# EAGLE design pyboard (EAGLE 6.5.0)
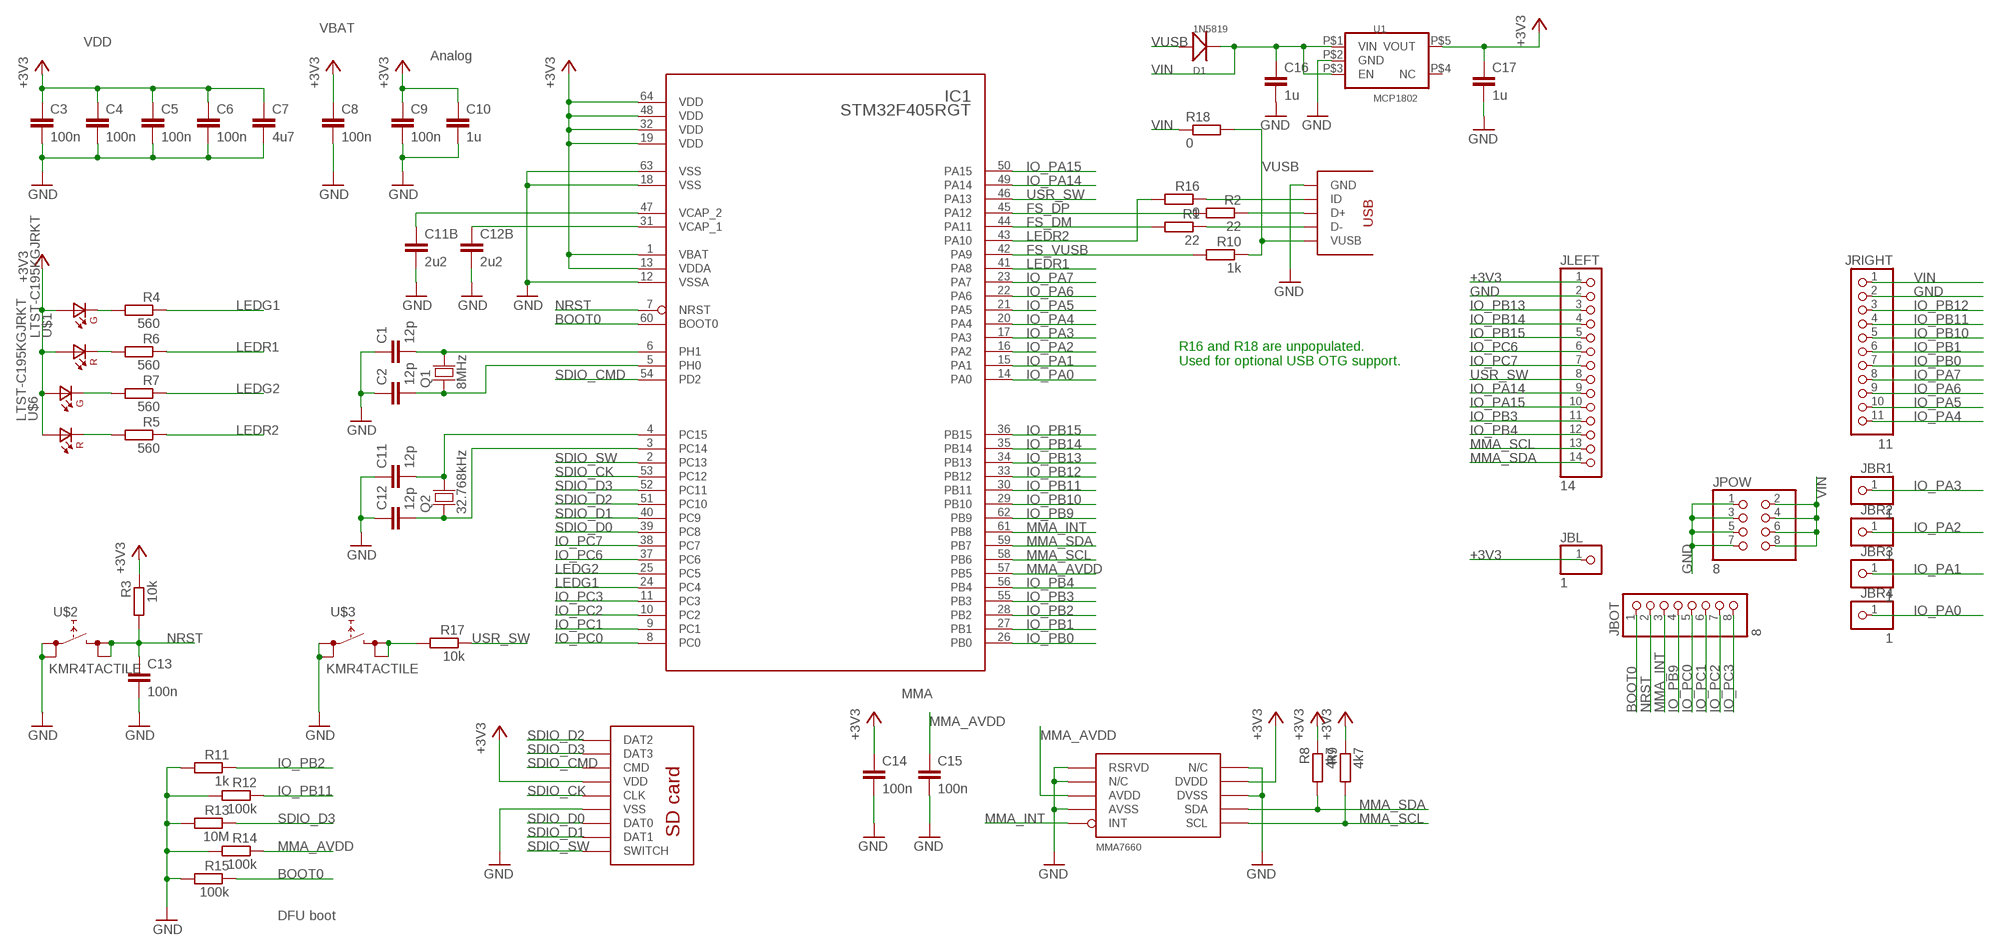
[diagram p0: schematic, sheet 1]

## Parts
C1  12p  C-EUC0603  [C0603]
C2  12p  C-EUC0603  [C0603]
C3  100n  C-EUC0603  [C0603]
C4  100n  C-EUC0603  [C0603]
C5  100n  C-EUC0603  [C0603]
C6  100n  C-EUC0603  [C0603]
C7  4u7  C-EUC0603  [C0603]
C8  100n  C-EUC0603  [C0603]
C9  100n  C-EUC0603  [C0603]
C10  1u  C-EUC0603  [C0603]
C11  12p  C-EUC0603  [C0603]
C11B  2u2  C-EUC0603  [C0603]
C12  12p  C-EUC0603  [C0603]
C12B  2u2  C-EUC0603  [C0603]
C13  100n  C-EUC0603  [C0603]
C14  100n  C-EUC0603  [C0603]
C15  100n  C-EUC0603  [C0603]
C16  1u  C-EUC0603  [C0603]
C17  1u  C-EUC0603  [C0603]
D1  1N5819  [SOD-123]
IC1  STM32F405RGT  [LQFP64]
JBL  1  PINHD-1X1  [1X01]
JBOT  8  PINHD-1X8  [1X08]
JBR1  1  PINHD-1X1  [1X01]
JBR2  1  PINHD-1X1  [1X01]
JBR3  1  PINHD-1X1  [1X01]
JBR4  1  PINHD-1X1  [1X01]
JLEFT  14  PINHD-1X14  [1X14]
JPOW  8  PINHD-2X4  [2X04]
JRIGHT  11  PINHD-1X11  [1X11]
Q1  8MHz  TXC-CRYSTAL50X32  [TXC-SMD-50X32]
Q2  32.768kHz  TXC-CRYSTAL32X15  [TXC-SMD-32X15]
R1  22  R-EU_R0603  [R0603]
R2  22  R-EU_R0603  [R0603]
R3  10k  R-EU_R0603  [R0603]
R4  560  R-EU_R0603  [R0603]
R5  560  R-EU_R0603  [R0603]
R6  560  R-EU_R0603  [R0603]
R7  560  R-EU_R0603  [R0603]
R8  4k7  R-EU_R0603  [R0603]
R9  4k7  R-EU_R0603  [R0603]
R10  1k  R-EU_R0603  [R0603]
R11  1k  R-EU_R0603  [R0603]
R12  100k  R-EU_R0603  [R0603]
R13  10M  R-EU_R0603  [R0603]
R14  100k  R-EU_R0603  [R0603]
R15  100k  R-EU_R0603  [R0603]
R16  0  R-EU_R0603  [R0603]
R17  10k  R-EU_R0603  [R0603]
R18  0  R-EU_R0805  [R0805]
U1  MCP1802  [SOT-23-5]
U$1  LTST-C195KGJRKT  [LTST-BILED-15X16]
U$2  KMR4TACTILE  [KMR4SWITCH]
U$3  KMR4TACTILE  [KMR4SWITCH]
U$4  MOLEX-SD-105027  [MOLEX-SD-105027-PKG]
U$5  MMA7660  [DFN10]
U$6  LTST-C195KGJRKT  [LTST-BILED-15X16]
U$7  USB-MICRO-AB  [HRS-USB-ZX62D-AB-5P8-PKG]

## Nets
+3V3: C3.1 C4.1 C5.1 C6.1 C7.1 C8.1 C9.1 C10.1 C14.1 C17.1 IC1.1(VBAT) IC1.13(VDDA) IC1.19(VDD) IC1.32(VDD) IC1.48(VDD) IC1.64(VDD) JBL.1 JLEFT.1 R3.1 R8.1 R9.1 U1.P$5(VOUT) U$1.P$1(A1) U$1.P$2(A2) U$4.P$4(VDD) U$5.P$9(DVDD) U$6.P$1(A1) U$6.P$2(A2)
BOOT0: IC1.60(BOOT0) JBOT.1 R15.1
FS_DM: IC1.44(PA11) R1.2
FS_DP: IC1.45(PA12) R2.2
FS_VUSB: IC1.42(PA9) R10.2
GND: C1.1 C2.1 C3.2 C4.2 C5.2 C6.2 C7.2 C8.2 C9.2 C10.2 C11.1 C11B.2 C12.1 C12B.2 C13.2 C14.2 C15.2 C16.2 C17.2 IC1.12(VSSA) IC1.18(VSS) IC1.63(VSS) JLEFT.2 JPOW.1 JPOW.3 JPOW.5 JPOW.7 JRIGHT.2 R11.2 R12.2 R13.2 R14.2 R15.2 U1.P$2(GND) U$2.P$1 U$2.P$2 U$3.P$1 U$3.P$2 U$4.P$6(VSS) U$5.P$1(RSRVD) U$5.P$2(N/C) U$5.P$4(AVSS) U$5.P$8(DVSS) U$5.P$10(N/C) U$7.P$5(GND)
IO_PA0: IC1.14(PA0) JBR4.1
IO_PA1: IC1.15(PA1) JBR3.1
IO_PA2: IC1.16(PA2) JBR2.1
IO_PA3: IC1.17(PA3) JBR1.1
IO_PA4: IC1.20(PA4) JRIGHT.11
IO_PA5: IC1.21(PA5) JRIGHT.10
IO_PA6: IC1.22(PA6) JRIGHT.9
IO_PA7: IC1.23(PA7) JRIGHT.8
IO_PA14: IC1.49(PA14) JLEFT.9
IO_PA15: IC1.50(PA15) JLEFT.10
IO_PB0: IC1.26(PB0) JRIGHT.7
IO_PB1: IC1.27(PB1) JRIGHT.6
IO_PB2: IC1.28(PB2) R11.1
IO_PB3: IC1.55(PB3) JLEFT.11
IO_PB4: IC1.56(PB4) JLEFT.12
IO_PB9: IC1.62(PB9) JBOT.4
IO_PB10: IC1.29(PB10) JRIGHT.5
IO_PB11: IC1.30(PB11) JRIGHT.4 R12.1
IO_PB12: IC1.33(PB12) JRIGHT.3
IO_PB13: IC1.34(PB13) JLEFT.3
IO_PB14: IC1.35(PB14) JLEFT.4
IO_PB15: IC1.36(PB15) JLEFT.5
IO_PC0: IC1.8(PC0) JBOT.5
IO_PC1: IC1.9(PC1) JBOT.6
IO_PC2: IC1.10(PC2) JBOT.7
IO_PC3: IC1.11(PC3) JBOT.8
IO_PC6: IC1.37(PC6) JLEFT.6
IO_PC7: IC1.38(PC7) JLEFT.7
LEDG1: IC1.24(PC4) R4.1
LEDG2: IC1.25(PC5) R7.1
LEDR1: IC1.41(PA8) R6.1
LEDR2: IC1.43(PA10) R5.1 R16.2
MMA_AVDD: C15.1 IC1.57(PB5) R14.1 U$5.P$3(AVDD)
MMA_INT: IC1.61(PB8) JBOT.3 U$5.P$5(INT)
MMA_SCL: IC1.58(PB6) JLEFT.13 R9.2 U$5.P$6(SCL)
MMA_SDA: IC1.59(PB7) JLEFT.14 R8.2 U$5.P$7(SDA)
N$1: C11B.1 IC1.47(VCAP_2)
N$2: C12B.1 IC1.31(VCAP_1)
N$3: R2.1 U$7.P$3(D+)
N$4: R1.1 U$7.P$2(D-)
N$5: C12.2 IC1.3(PC14) Q2.P$1
N$6: C11.2 IC1.4(PC15) Q2.P$2
N$7: R16.1 U$7.P$4(ID)
N$9: C1.2 IC1.6(PH1) Q1.P$2
N$10: C2.2 IC1.5(PH0) Q1.P$1
N$11: R4.2 U$1.P$3(K1)
N$12: R5.2 U$6.P$4(K2)
N$13: R6.2 U$1.P$4(K2)
N$14: R7.2 U$6.P$3(K1)
N$15: R17.2 U$3.P$3 U$3.P$4
NRST: C13.1 IC1.7(NRST) JBOT.2 R3.2 U$2.P$3 U$2.P$4
SDIO_CK: IC1.53(PC12) U$4.P$5(CLK)
SDIO_CMD: IC1.54(PD2) U$4.P$3(CMD)
SDIO_D0: IC1.39(PC8) U$4.P$7(DAT0)
SDIO_D1: IC1.40(PC9) U$4.P$8(DAT1)
SDIO_D2: IC1.51(PC10) U$4.P$1(DAT2)
SDIO_D3: IC1.52(PC11) R13.1 U$4.P$2(DAT3)
SDIO_SW: IC1.2(PC13) U$4.G$1(SWITCH)
USR_SW: IC1.46(PA13) JLEFT.8 R17.1
VIN: C16.1 D1.K JPOW.2 JPOW.4 JPOW.6 JPOW.8 JRIGHT.1 R18.1 U1.P$1(VIN) U1.P$3(EN)
VUSB: D1.A R10.1 R18.2 U$7.P$1(VUSB)
Unconnected: U1.P$4(NC)

## Notes on the sheet
- VBAT
- VDD
- Analog
- R16 and R18 are unpopulated.
  Used for optional USB OTG support.
- MMA
- DFU boot

## Library data of the parts
C1-C11 C11B C12 C12B C13-C17 = rcl:C-EU: CAPACITOR, European symbol
D1 = pyboard:1N5819
IC1 = pyboard:STM32F405R*T: STM32F405R*T ARM Cortex-M4 32b MCU+FPU, 210DMIPS, up to 1MB Flash/192+4KB RAM, USB OTG HS/FS, 17 TIMs, 3 ADCs, 15 comm.
JBL JBR1-JBR4 = pinhead:PINHD-1X1: PIN HEADER
JBOT = pinhead:PINHD-1X8: PIN HEADER
JLEFT = pinhead:PINHD-1X14: PIN HEADER
JPOW = pinhead:PINHD-2X4: PIN HEADER
JRIGHT = pinhead:PINHD-1X11: PIN HEADER
Q1 Q2 = pyboard:TXC-CRYSTAL
R1-R18 = rcl:R-EU_: RESISTOR, European symbol
U1 = pyboard:MCP1802
U$1 U$6 = pyboard:LTST-C195KGJRKT
U$2 U$3 = pyboard:KMR4TACTILE
U$4 = pyboard:MOLEX-SD-105027
U$5 = pyboard:MMA7660
U$7 = pyboard:USB-MICRO-AB

## Net classes
0 default: width 0.15 mm, drill 0.25 mm, clearance 0.15 mm

## Board
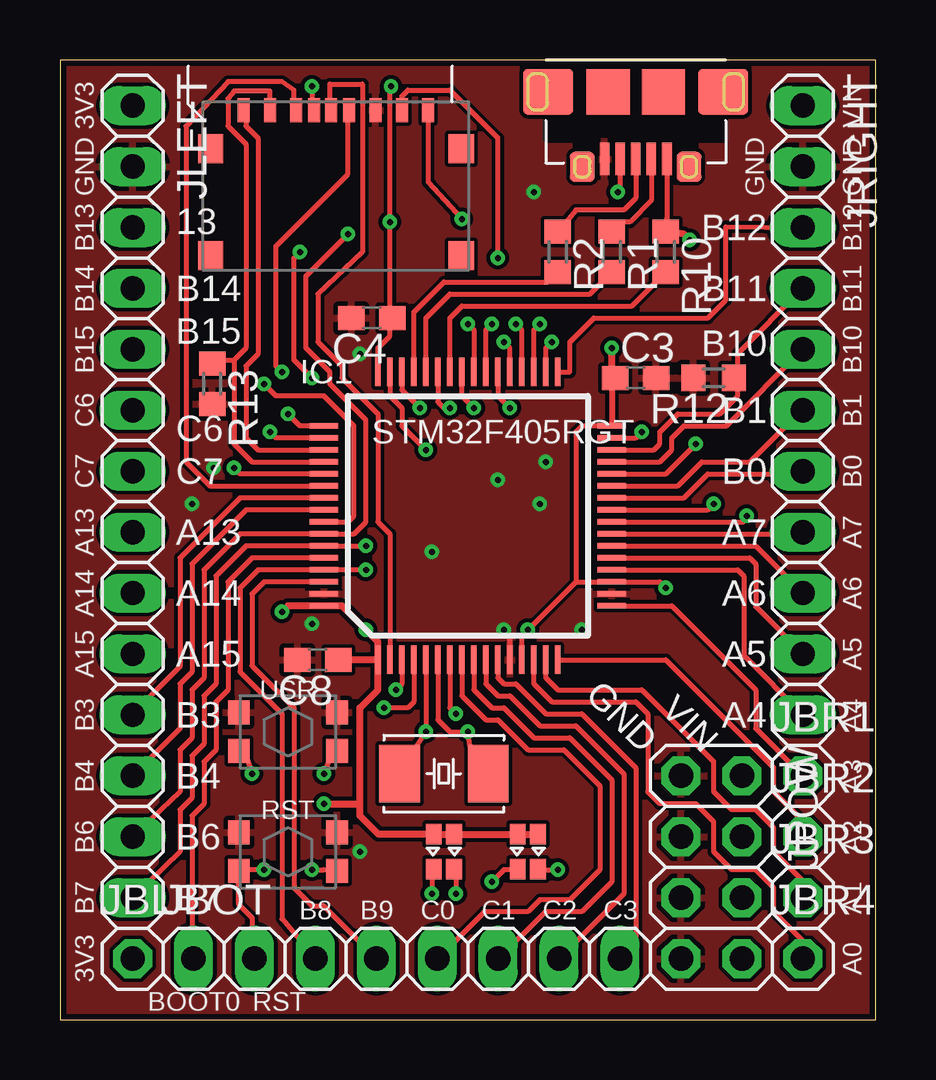
[diagram p1: board, top side]
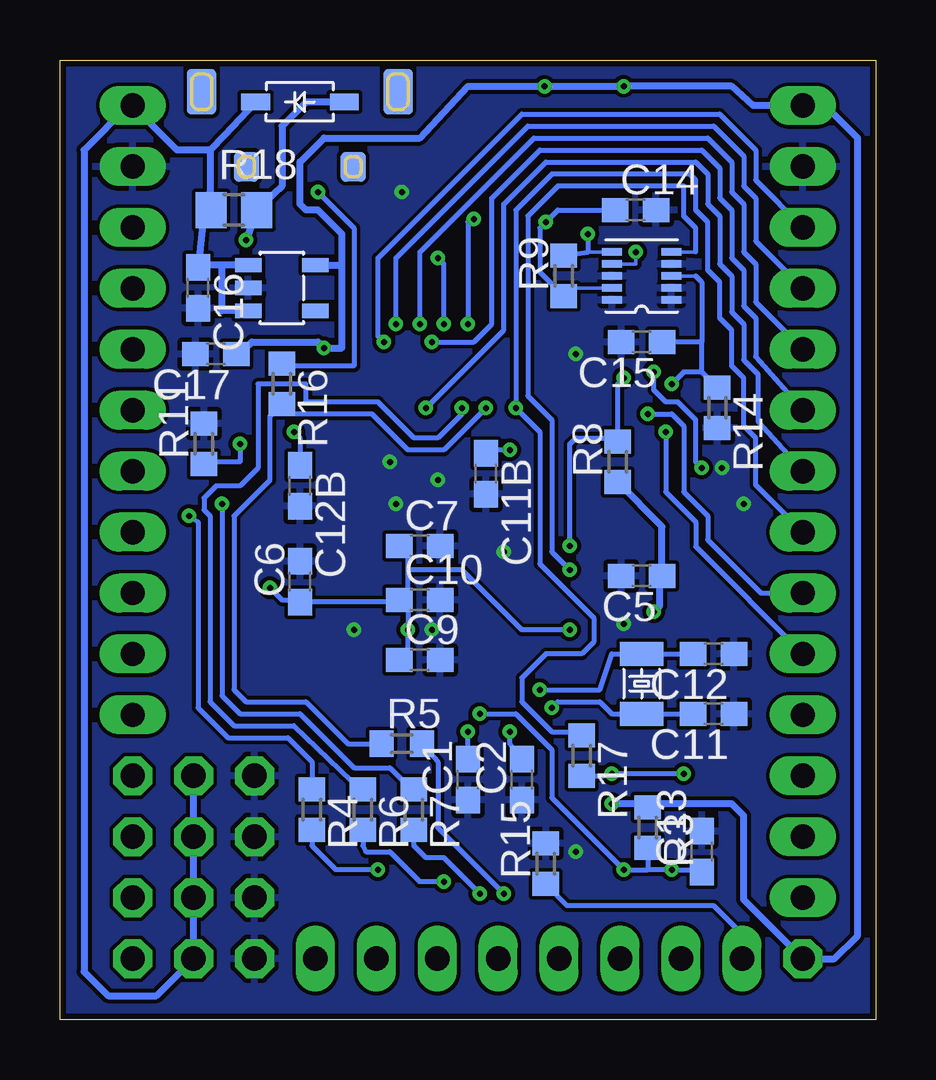
[diagram p2: board, bottom side, seen from below]

Size 34 x 40 mm. Coordinates in mm from the lower left corner, seen from the top.
Outline: 0,0 34,0 34,40 0,40 0,0
Copper layers (1*16): Top 0.018mm / dielectric 1.55mm / Bottom 0.018mm
Design rules "eC_2Layer_PClass6_BaseCopperO18_eCDefault *": minimum track width 0.15mm, minimum drill 0.25mm, track to track 0.15mm, track to pad 0.15mm, pad to pad 0.15mm, via to via 0.15mm, smd to smd 0mil, copper to edge 0.25mm, drill to drill 0.35mm, minimum pad ring 0.175mm, minimum via ring 0.175mm, stop-mask expansion 0mil, vias tented up to drill 0.45mm, thermal gap 0.2mm

### Footprints (pad centres in the part's own frame; a part is rotated, then mirrored left to right if it is on the bottom)
C0603 = smd 1.1 x 1: 1 -0.85,0; 2 0.85,0
SOD-123 = smd 1.2 x 0.7: A -1.85,0; K 1.85,0
LQFP64 = smd 0.24 x 1.2: 1 -3.75,-6; 2 -3.25,-6; 3 -2.75,-6; 4 -2.25,-6; 5 -1.75,-6; 6 -1.25,-6; 7 -0.75,-6; 8 -0.25,-6; 9 0.25,-6; 10 0.75,-6; 11 1.25,-6; 12 1.75,-6; 13 2.25,-6; 14 2.75,-6; 15 3.25,-6; 16 3.75,-6; 33 3.75,6; 34 3.25,6; 35 2.75,6; 36 2.25,6; 37 1.75,6; 38 1.25,6; 39 0.75,6; 40 0.25,6; 41 -0.25,6; 42 -0.75,6; 43 -1.25,6; 44 -1.75,6; 45 -2.25,6; 46 -2.75,6; 47 -3.25,6; 48 -3.75,6 | smd 1.2 x 0.24: 17 6,-3.75; 18 6,-3.25; 19 6,-2.75; 20 6,-2.25; 21 6,-1.75; 22 6,-1.25; 23 6,-0.75; 24 6,-0.25; 25 6,0.25; 26 6,0.75; 27 6,1.25; 28 6,1.75; 29 6,2.25; 30 6,2.75; 31 6,3.25; 32 6,3.75; 49 -6,3.75; 50 -6,3.25; 51 -6,2.75; 52 -6,2.25; 53 -6,1.75; 54 -6,1.25; 55 -6,0.75; 56 -6,0.25; 57 -6,-0.25; 58 -6,-0.75; 59 -6,-1.25; 60 -6,-1.75; 61 -6,-2.25; 62 -6,-2.75; 63 -6,-3.25; 64 -6,-3.75
1X01 = drill 1.016 octagon: 1 0,0
1X08 = drill 1.016 long: 1 -8.89,0; 2 -6.35,0; 3 -3.81,0; 4 -1.27,0; 5 1.27,0; 6 3.81,0; 7 6.35,0; 8 8.89,0
1X14 = drill 1.016 long: 1 -16.51,0; 2 -13.97,0; 3 -11.43,0; 4 -8.89,0; 5 -6.35,0; 6 -3.81,0; 7 -1.27,0; 8 1.27,0; 9 3.81,0; 10 6.35,0; 11 8.89,0; 12 11.43,0; 13 13.97,0; 14 16.51,0
2X04 = drill 1.016 octagon: 1 -3.81,-1.27; 2 -3.81,1.27; 3 -1.27,-1.27; 4 -1.27,1.27; 5 1.27,-1.27; 6 1.27,1.27; 7 3.81,-1.27; 8 3.81,1.27
1X11 = drill 1.016 long: 1 -12.7,0; 2 -10.16,0; 3 -7.62,0; 4 -5.08,0; 5 -2.54,0; 6 0,0; 7 2.54,0; 8 5.08,0; 9 7.62,0; 10 10.16,0; 11 12.7,0
TXC-SMD-50X32 = smd 1.7 x 2.4: P$1 -1.85,0; P$2 1.85,0
TXC-SMD-32X15 = smd 1 x 1.8: P$1 -1.25,0; P$2 1.25,0
R0603 = smd 1 x 1.1: 1 -0.85,0; 2 0.85,0
R0805 = smd 1.3 x 1.5: 1 -0.95,0; 2 0.95,0
SOT-23-5 = smd 0.6 x 1.1: P$1 -0.95,-1.4; P$2 0,-1.4; P$3 0.95,-1.4; P$4 0.95,1.4; P$5 -0.95,1.4
LTST-BILED-15X16 = smd 0.65 x 0.85: P$1 0.425,0.725; P$2 -0.425,0.725; P$3 0.425,-0.725; P$4 -0.425,-0.725
KMR4SWITCH = smd 0.9 x 1: P$1 2.05,0.8; P$2 -2.05,0.8; P$3 -2.05,-0.8; P$4 2.05,-0.8
MOLEX-SD-105027-PKG = smd 0.5 x 1: G$1 0.2,-6.66; P$1 3.85,-6.66; P$2 2.75,-6.66; P$3 1.65,-6.66; P$4 0.9,-6.66; P$5 -0.55,-6.66; P$6 -1.65,-6.66; P$7 -2.75,-6.66; P$8 -3.85,-6.66 | smd 1.05 x 1.2: M$1 5.225,-0.6; M$2 5.225,-5.05; M$3 -5.225,-0.6; M$4 -5.225,-5.05
DFN10 = smd 0.3 x 0.825: P$1 1,1.24; P$2 0.5,1.24; P$3 0,1.24; P$4 -0.5,1.24; P$5 -1,1.24; P$6 -1,-1.24; P$7 -0.5,-1.24; P$8 0,-1.24; P$9 0.5,-1.24; P$10 1,-1.24
HRS-USB-ZX62D-AB-5P8-PKG = smd 0.4 x 1.35: P$1 -1.3,2.8; P$2 -0.65,2.8; P$3 0,2.8; P$4 0.65,2.8; P$5 1.3,2.8 | smd 1.8 x 1.9: P$6 -1.15,0; P$7 1.15,0 | smd 2.1 x 1.9: P$8 -3.65,0; P$9 3.65,0 | smd 1.05 x 1.25: P$10 -2.225,3.125; P$11 2.225,3.125 | smd 1.05 x 1.25 bottom: P$12 -2.225,3.125; P$13 2.225,3.125 | smd 1.2 x 1.9 bottom: P$14 4.1,0; P$15 -4.1,0

### Placement (x,y rotation side)
C1  17,10 90 bottom
C2  14.75,10 90 bottom
C3  24,26.75 0 top
C4  13,29.25 180 top
C5  9.75,18.5 180 bottom
C6  24,18.25 90 bottom
C7  19,19.75 0 bottom
C8  10.75,15 180 top
C9  19,15 0 bottom
C10  19,17.5 0 bottom
C11  6.75,12.75 180 bottom
C11B  16.25,22.75 270 bottom
C12  6.75,15.25 180 bottom
C12B  24,22.25 270 bottom
C13  7.25,7 90 bottom
C14  10,33.75 0 bottom
C15  9.75,28.25 180 bottom
C16  28.25,30.5 270 bottom
C17  27.5,27.75 180 bottom
D1  24,38.25 180 bottom
IC1  17,21 0 top
JBL  3.03,2.54 0 top
JBOT  14.46,2.54 0 top
JBR1  30.97,10.16 0 top
JBR2  30.97,7.62 0 top
JBR3  30.97,5.08 0 top
JBR4  30.97,2.54 0 top
JLEFT  3.03,21.59 270 top
JPOW  27.16,6.35 270 top
JRIGHT  30.97,25.4 270 top
Q1  16,10.25 0 top
Q2  9.75,14 270 bottom
R1  23,32 270 top
R2  20.75,32 270 top
R3  9.5,8 270 bottom
R4  23.5,8.75 270 bottom
R5  19.75,11.5 0 bottom
R6  21.38,8.75 270 bottom
R7  19.25,8.75 270 bottom
R8  10.75,23.25 90 bottom
R9  13,31 90 bottom
R10  25.25,32 270 top
R11  28,24 90 bottom
R12  27.25,26.75 180 top
R13  6.35,26.5 270 top
R14  6.6,25.5 270 bottom
R15  13.75,6.5 90 bottom
R16  24.75,26.5 270 bottom
R17  12.25,11 270 bottom
R18  26.75,33.75 0 bottom
U1  24.75,30.5 270 bottom
U$1  19.5,7 0 top
U$2  9.5,7 0 top
U$3  9.5,12 0 top
U$4  11.5,31.25 180 top
U$5  9.75,31 270 bottom
U$6  16,7 0 top
U$7  24,38.67 180 top

### Tracks (layer width: path | path; a pad name or v marks a point on that pad's centre or on a via)
+3V3  (via drill 0.25)
  Top 0.2: v25.25,18 25,18.25 IC1.19 21.5,18.25 | 23,26.6 C3.1 | IC1.13 19.25,16 v19.5,16.25 21.5,18.25 | IC1.32 21.75,24.75 21.5,24.5 21.5,18.25 | v10.5,38.9 10.5,38.01 U$4.P$4 | IC1.48 13.25,28 13.75,28.5 13.75,29.25 | 13.75,29.25 C4.1 | 13.75,29.25 v13.75,33.25 13.75,38.75 13.8,38.8 v13.8,38.9
  Top 0.25: 23,26.5 IC1.32
  Top 0.3: IC1.1 C8.1 | 12.5,9 12.5,8.5 13.28,7.72 U$6.P$2 U$6.P$1 U$1.P$2 U$1.P$1 | 12.5,9 12.5,13 13.25,13.75 IC1.1 | v11,9 12.5,9 | IC1.1 13.25,15.75 v12.75,16.25 11.75,17.25 IC1.64 9.5,17.25 v9.25,17 | 23,26.6 v23,28
  Bottom 0.15: U$5.P$9 12.9,30.5
  Bottom 0.2: v25.25,18 24.75,17.5 24.1,17.5 C6.1 19.95,17.4 C10.1 | C10.1 19.5,17.5 v19.5,16.25 19.5,15 C9.1 | v12.75,16.25 14.75,16.25 17.25,18.75 19.5,18.75 | C10.1 19.5,17.85 19.5,18.75 | 19.5,18.75 19.5,19.5 19.75,19.75 C7.1 | 9,18.4 C5.1 | 12.9,30.5 R9.1 14,31.15 14,33 v13.75,33.25 13.25,33.75 C14.1 | 2.93,38 JLEFT.1 | JBL.1 | R3.1 9.75,9.1 10,9 | 22.3,31.45 22.25,31.5
  Bottom 0.3: v11,9 10,9 6,9 5.5,8.5 5.5,5 JBL.1 | v9.25,17 9,17.25 9,18.4 | C5.1 8.9,20.55 R8.1 | JLEFT.1 5.1,38.1 6,38.9 v10.5,38.9 v13.8,38.9 17,38.9 19,36.75 23,36.75 24,35.75 24,34 23.75,33.75 23.25,33.75 22.25,32.75 22.25,31.5 22.25,28 v23,28 23.25,28.25 26,28.25 C17.1 | JBL.1 1.71,2.54 0.75,3.5 0.75,36.75 2,38 2.93,38 | U1.P$5 22.3,31.45
BOOT0
  Top 0.2: IC1.60 8,19.25 7,18.25 7,13.75 6.5,13.25 6.5,11.25 6,10.75 6,9 5.5,8.5 5.5,2.61 JBOT.1
  Bottom 0.2: JBOT.1 5.57,3.57 6.75,4.75 12.85,4.75 R15.1
FS_DM
  Top 0.2: IC1.44 15.25,29.25 16.25,30.25 22.1,30.25 R1.2
FS_DP
  Top 0.2: IC1.45 14.75,29.5 16,30.75 20.35,30.75 R2.2
FS_VUSB
  Top 0.2: IC1.42 16.25,29.25 16.75,29.75 23.85,29.75 R10.2
GND  (via drill 0.25)
  Top 0.2: IC1.12 18.75,16 v18.5,16.25
  other vias: 20.25,23.25 20,21.5 18.25,22.5 15.5,19.5 10.5,16.5 12.5,7 21.75,16.25 12.5,27.75 5.5,21.5 6.4,23 19.75,34.5
  pour Bottom (isolate 0.16): 0,0 0,40 34,40 34,0
  pour Top (isolate 0.16): 0,0 0,40 34,40 34,0
IO_PA0
  Top 0.2: JBR4.1 30.97,3.28 29.75,4.5 29.75,5.5 29,6.25 28,6.25 27.25,7 27.25,8.25 26.5,9 25,9 24.5,9.5 24.5,12.75 24,13.25 20.5,13.25 19.75,14 IC1.14 19.75,14.75
IO_PA1
  Top 0.2: JBR3.1 30.97,5.78 29.75,7 29.75,8 29,8.75 28,8.75 27.25,9.5 27.25,10.75 24.25,13.75 20.75,13.75 20.25,14.25 IC1.15
IO_PA2
  Top 0.2: JBR2.1 30.97,8.28 29.75,9.5 29.75,10.5 25.25,15 IC1.16
IO_PA3
  Top 0.2: IC1.17 25.5,17.25 29,13.75 29,12.13 JBR1.1
IO_PA4
  Top 0.2: IC1.20 28.25,18.75 28.5,18.5 28.5,15.17 JRIGHT.11
IO_PA5
  Top 0.2: IC1.21 28.75,19.25 29,19 29,17.21 JRIGHT.10
IO_PA6
  Top 0.2: IC1.22 29,19.75 JRIGHT.9
IO_PA7
  Top 0.2: IC1.23 30.9,20.25 JRIGHT.8
IO_PA14  (via drill 0.25)
  Top 0.2: IC1.49 10,24.75 v9.5,25.25
  Bottom 0.2: v9.5,25.25 8.5,25.25 8,24.75 8,22 7,21 7,20 4.78,17.78 JLEFT.9
IO_PA15  (via drill 0.25)
  Top 0.2: IC1.50 9,24.25 v8.75,24.5
  Bottom 0.2: v8.75,24.5 8.75,22 7.5,20.75 7.5,19.71 JLEFT.10
IO_PB0
  Top 0.2: IC1.26 26,21.75 27,22.75 30.86,22.75 JRIGHT.7
IO_PB1
  Top 0.2: IC1.27 25.75,22.25 26.75,23.25 28.75,23.25 30.75,25.25 30.82,25.25 JRIGHT.6
IO_PB2  (via drill 0.25)
  Top 0.2: IC1.28 25.25,22.75 v26.5,24
  Bottom 0.2: v26.5,24 26.5,23.25 27.5,23.25 R11.1
IO_PB3
  Top 0.2: IC1.55 7.5,21.75 5,19.25 5,14.71 3.03,12.74 JLEFT.11
IO_PB4
  Top 0.2: IC1.56 7.75,21.25 5.5,19 5.5,14.5 5,14 5,12.13 JLEFT.12
IO_PB9
  Top 0.2: IC1.62 8.5,18.25 8,17.75 8,14.75 9.75,13 9.75,5.5 10.5,4.75 10.98,4.75 JBOT.4
IO_PB10
  Top 0.2: IC1.29 25,23.25 25.5,23.75 25.5,24.25 26,24.75 27.78,24.75 JRIGHT.5
IO_PB11
  Top 0.2: IC1.30 24.75,23.75 25,24 25,24.5 25.75,25.25 27.5,25.25 28.25,26 28.25,26.6 R12.1 28.1,26.85 28.25,27 28.25,27.76 JRIGHT.4
IO_PB12
  Top 0.2: IC1.33 21.25,27 21.25,28.25 22.25,29.25 27,29.25 27.75,30 27.75,33.05 JRIGHT.3
IO_PB13  (via drill 0.25)
  Top 0.2: IC1.34 20.25,28 v20.5,28.25
  Bottom 0.2: v20.5,28.25 20.75,28.5 20.75,31.75 14.75,37.75 6.5,37.75 5,36.25 5,35 JLEFT.3
IO_PB14  (via drill 0.25)
  Top 0.2: IC1.35 19.75,28.75 v20,29
  Bottom 0.2: v20,29 20,31.75 14.5,37.25 6.75,37.25 5.5,36 5.5,34.75 5,34.25 5,32.45 JLEFT.4
IO_PB15  (via drill 0.25)
  Top 0.2: IC1.36 19.25,28.75 v19,29
  Bottom 0.2: v19,29 19,32 14.25,36.75 7,36.75 6,35.75 6,34.5 5.5,34 5.5,32 5,31.5 5,29.91 JLEFT.5
IO_PC0
  Top 0.2: JBOT.5 17.69,4.5 19.5,4.5 20,5 21.25,5 22.5,6.25 22.5,9.75 21,11.25 19.5,11.25 18.25,12.5 17.75,12.5 16.75,13.5 IC1.8
IO_PC1
  Top 0.2: JBOT.6 20.23,4.5 21.75,4.5 23,5.75 23,10 21.25,11.75 19.75,11.75 18.5,13 18,13 17.25,13.75 IC1.9
IO_PC2
  Top 0.2: JBOT.7 23.5,5.23 23.5,10.25 21.5,12.25 20,12.25 18.75,13.5 18.25,13.5 17.75,14 IC1.10
IO_PC3
  Top 0.2: JBOT.8 24,3.19 24,10.5 21.75,12.75 20.25,12.75 19,14 18.5,14 18.25,14.25 IC1.11
IO_PC6  (via drill 0.25)
  Top 0.2: IC1.37 18.75,28 v18.5,28.25
  Bottom 0.2: v18.5,28.25 16.75,28.25 16,29 16,34.25 14,36.25 7.25,36.25 6.5,35.5 6.5,34.25 6,33.75 6,31.75 5.5,31.25 5.5,29.75 5,29.25 5,27.62 JLEFT.6
IO_PC7  (via drill 0.25)
  Top 0.2: IC1.38 18.25,26 v18.75,25.5
  Bottom 0.2: v18.75,25.5 15.5,28.75 15.5,34 13.75,35.75 7.5,35.75 7,35.25 7,34 6.5,33.5 6.5,31.5 6,31 6,29.5 5.5,29 5.5,27.5 4.9,26.9 4.9,24.93 JLEFT.7
LEDG1  (via drill 0.25)
  Top 0.2: IC1.24 28.5,20.75 v28.62,21
  Bottom 0.2: v28.62,21 28.25,20.75 28.25,13 27,11.75 24.5,11.75 23.5,10.75 R4.1
LEDG2  (via drill 0.25)
  Top 0.2: IC1.25 27,21.25 v27.25,21.5
  Bottom 0.2: v27.25,21.5 27.25,13.5 26.5,12.75 24,12.75 21.75,10.5 20.25,10.5 19.25,9.5 R7.1
LEDR1  (via drill 0.25)
  Top 0.2: v17.25,25.5 16.75,26 IC1.41
  Bottom 0.2: v17.25,25.5 17.25,25.25 18.25,24.25 19.25,24.25 20.75,25.75 23.75,25.75 23.75,26.5 25.75,26.5 25.75,23 26.5,22.25 27.5,22.25 28,21.75 28,21.25 27.75,21 27.75,13.25 26.75,12.25 24.25,12.25 21.38,9.5 R6.1
LEDR2  (via drill 0.25)
  Top 0.2: IC1.43 15.75,25.75 16,25.5 v16.25,25.5
  Bottom 0.2: v16.25,25.5 18,23.75 19.5,23.75 21,25.25 24.35,25.25 R16.2 25.25,25.15 25.25,22.5 26.75,21 26.75,13.75 26.25,13.25 23.75,13.25 22,11.5 R5.1
MMA_AVDD  (via drill 0.25)
  Top 0.2: IC1.57 12,20.75 12.25,21 12.25,24.75 11,26 9,26 v8.5,26.5
  Bottom 0.15: 7.5,31 U$5.P$3
  Bottom 0.2: 7.5,31 7.25,30.75 7.25,28.25 | 7.25,28.25 C15.1 | R14.1 7.25,27 | 7.25,27 7.25,28.25 | 7.25,27 8,27 v8.5,26.5
MMA_INT  (via drill 0.25)
  Top 0.2: JBOT.3 9.25,4.19 9.25,12.75 7.5,14.5 7.5,18 8.25,18.75 IC1.61 v12.75,18.75
  Bottom 0.15: U$5.P$5 7.5,32
  Bottom 0.2: 7.5,32 7.5,33 8,33.5 8,34.75 13.25,34.75 14.5,33.5 14.5,26 13.5,25 13.5,19.5 v12.75,18.75
MMA_SCL  (via drill 0.25)
  Top 0.2: v12,32.75 10.25,31 10.25,28 11.25,27 11.25,26.5 12.75,25 12.75,20.75 12.25,20.25 IC1.58 7.5,20.25 6,18.75 6,14.25 5.5,13.75 5.5,11.75 5,11.25 5,9.5 JLEFT.13
  Bottom 0.15: 12,32 U$5.P$6
  Bottom 0.2: v12,32.75 12,32 R9.2
MMA_SDA  (via drill 0.25)
  Top 0.2: v12.75,19.75 IC1.59 7.75,19.75 6.5,18.5 6.5,14 6,13.5 6,11.5 5.5,11 5.5,9.25 5,8.75 5,7 JLEFT.14 | v10.5,26.75 9.75,27.5 9.75,31.75 v10,32
  Bottom 0.15: v10,32 10,31.5 U$5.P$7
  Bottom 0.2: v12.75,19.75 12.75,24 12.5,24.25 10.75,24.25 | v10.5,26.75 10.75,26.5 10.75,24.25 | R8.2 10.75,24.25
N$1  (via drill 0.25)
  Top 0.2: IC1.47 13.75,26 14.25,25.5 14.25,24.75 v15.25,23.75
  Bottom 0.2: v15.25,23.75 16.1,23.75 C11B.1
N$2  (via drill 0.25)
  Top 0.2: IC1.31 24,24.25 v24.25,24.5
  Bottom 0.2: v24.25,24.5 24,24.25 C12B.1
N$3
  Top 0.2: U$7.P$3 24,34.25 23.5,33.75 21.5,33.75 R2.1
N$4
  Top 0.2: U$7.P$2 24.65,34.15 23.75,33.25 23.15,33.25 R1.1
N$5  (via drill 0.25)
  Top 0.2: IC1.3 14.25,14 v14,13.75
  Bottom 0.2: v14,13.75 11.5,13.75 11,15.25 Q2.P$1 C12.2
N$6  (via drill 0.25)
  Top 0.2: IC1.4 14.75,13.25 14.5,13 v13.5,13
  Bottom 0.2: v13.5,13 13.25,13.25 11.5,13.25 11,12.75 Q2.P$2 C11.2
N$7  (via drill 0.25)
  Top 0.2: U$7.P$4 23.35,34.6 v23.25,34.5
  Bottom 0.2: R16.1 24.65,27.25 21.75,27.25 21.75,33 v23.25,34.5
N$9  (via drill 0.25)
  Top 0.2: IC1.6 15.75,12.5 16.25,12 v17,12 17.1,11.4 Q1.P$2
  Bottom 0.2: C1.2 v17,12
N$10  (via drill 0.25)
  Top 0.2: IC1.5 v15.25,12 14.75,11.25 Q1.P$1
  Bottom 0.2: C2.2 15.25,11.5 v15.25,12
N$11  (via drill 0.25)
  Top 0.2: U$1.P$3 20,6.25 v20.75,6.25
  Bottom 0.2: v20.75,6.25 22.5,6.25 23.5,7.25 R4.2
N$12  (via drill 0.25)
  Top 0.2: U$6.P$4 15.5,6 v15.5,5.25
  Bottom 0.2: R5.2 18.25,10.75 18.25,8 v15.5,5.25
N$13  (via drill 0.25)
  Top 0.2: U$1.P$4 19.02,6.28 19,6.25 18.5,6.25 v18,5.75
  Bottom 0.2: v18,5.75 19,5.75 20.25,7 21.25,7 21.38,7.25 R6.2
N$14  (via drill 0.25)
  Top 0.2: U$6.P$3 16.5,6 v16.5,5.25
  Bottom 0.2: v16.5,5.25 18,6.75 18.75,6.75 19.25,7.25 R7.2
N$15  (via drill 0.25)
  Top 0.2: U$3.P$3 7.75,11 v8,10.25 | v11,10.25 11.3,11 U$3.P$4
  Bottom 0.2: v8,10.25 v11,10.25 11.35,10.15 R17.2
NRST  (via drill 0.25)
  Top 0.2: JBOT.2 8,2.65 8,4.25 7.45,4.8 U$2.P$3 7.5,6.25 v8.5,6.25 | v10.5,6.25 11,6.25 U$2.P$4 | IC1.7 16.25,13 v16.5,12.75
  Bottom 0.2: 9.5,6.25 v8.5,6.25 7.25,6.25 C13.1 | 9.5,6.25 v10.5,6.25 13.5,9.25 13.5,11.25 15,12.75 v16.5,12.75 | R3.2 9.5,6.25
SDIO_CK  (via drill 0.25)
  Top 0.2: IC1.53 7.5,22.75 v7.25,23 | v9.25,27 9,27.25 9,32.25 12,35.25 12,37.86 U$4.P$5
  Bottom 0.2: v7.25,23 7.5,23.25 7.5,25 8.25,25.75 8.75,25.75 9.25,26.25 v9.25,27
SDIO_CMD
  Top 0.2: U$4.P$3 9.75,37.91 9.75,38.75 9.25,39.1 7,39.1 5.25,37.25 5.25,23.25 6.25,22.25 IC1.54
SDIO_D0  (via drill 0.25)
  Top 0.2: U$4.P$7 14.25,38.5 14.5,38.75 16.25,38.75 18.25,36.75 v18.25,31.75 | IC1.39 17.75,28.75 v18,29
  Bottom 0.2: v18,29 18,31.5 v18.25,31.75
SDIO_D1  (via drill 0.25)
  Top 0.2: U$4.P$8 15.35,34.9 v16.75,33.38 | v17,29 17.25,28.75 IC1.40
  Bottom 0.2: v16.75,33.38 17,33.25 v17,29
SDIO_D2
  Top 0.2: U$4.P$1 7.75,37.91 7.75,37.25 8.25,36.75 8.25,27.75 7.75,27.25 7.75,24.25 8.25,23.75 IC1.51
SDIO_D3
  Top 0.2: U$4.P$2 8.75,38.7 7.25,38.7 7,38.4 7,37.25 7.75,36.5 7.75,28 7.25,27.5 | 7.25,27.5 7.25,24 8,23.25 IC1.52 | R13.1 6.5,27.5 7.25,27.5
SDIO_SW
  Top 0.2: U$4.G$1 11.25,37.91 11.25,39 12.61,39 12.61,32 10.75,30.25 10.75,28.25 11.75,27.25 11.75,26.75 13.25,25.25 13.25,20.75 13.75,20.25 IC1.2
USR_SW  (via drill 0.25)
  Top 0.2: IC1.46 14.25,26.25 v15,25.5
  Bottom 0.2: R17.1 12.4,12 13.5,12 14.75,13.25 14.75,14.25 13.75,15.25 12.25,15.25 11.75,15.75 11.75,16.75 14,19 14,24.5 v15,25.5 15,33.75 13.5,35.25 7.75,35.25 7.5,35 7.5,33.75 7,33.25 7,31.25 6.5,30.75 6.5,29.25 6,28.75 6,27.25 5.5,26.75 5.5,24.75 5,24.25 5,22.29 JLEFT.8
VIN
  Bottom 0.2: JRIGHT.1 31.15,38.1 | R18.1 28,33.75
  Bottom 0.3: JPOW.2 JPOW.4 JPOW.6 JPOW.8 29.97,1 32,1 33,2 33,36.25 31.15,38.1 | D1.K 27.15,36.85 27.75,36.25 | 27.75,36.25 27.75,34.5 R18.1 | 28,33.75 C16.1 28.25,31.45 27.25,31.45 | 27.75,36.25 29.12,36.25 JRIGHT.1 | U1.P$1 27.25,31.45 | U1.P$3 27.25,29.55 27.25,31.45
VUSB  (via drill 0.25)
  Top 0.2: U$7.P$1 25.3,33.4 R10.1
  Top 0.3: v26.25,32.5 26,32.75 R10.1
  Bottom 0.3: D1.A 23.75,38.25 24.75,37.25 24.75,34.75 R18.2 v26.25,32.5

### Text on the board
tPlace: 3V3 | VIN | GND | GND | GND | B13 | 13 | B12 | B12 | B14 | B14 | B11 | B11 | B15 | B15 | B10 | B10 | C6 | C6 | B1 | B1 | C7 | C7 | B0 | B0 | A13 | A13 | A7 | A7 | A14 | A14 | A6 | A6 | A15 | A15 | A5 | A5 | USR | B3 | B3 | A4 | A4 | GND | VIN | B4 | B4 | A3 | RST | B6 | B6 | A2 | B7 | B7 | B8 | B9 | C0 | C1 | C2 | C3 | A1 | 3V3 | A0 | BOOT0 | RST